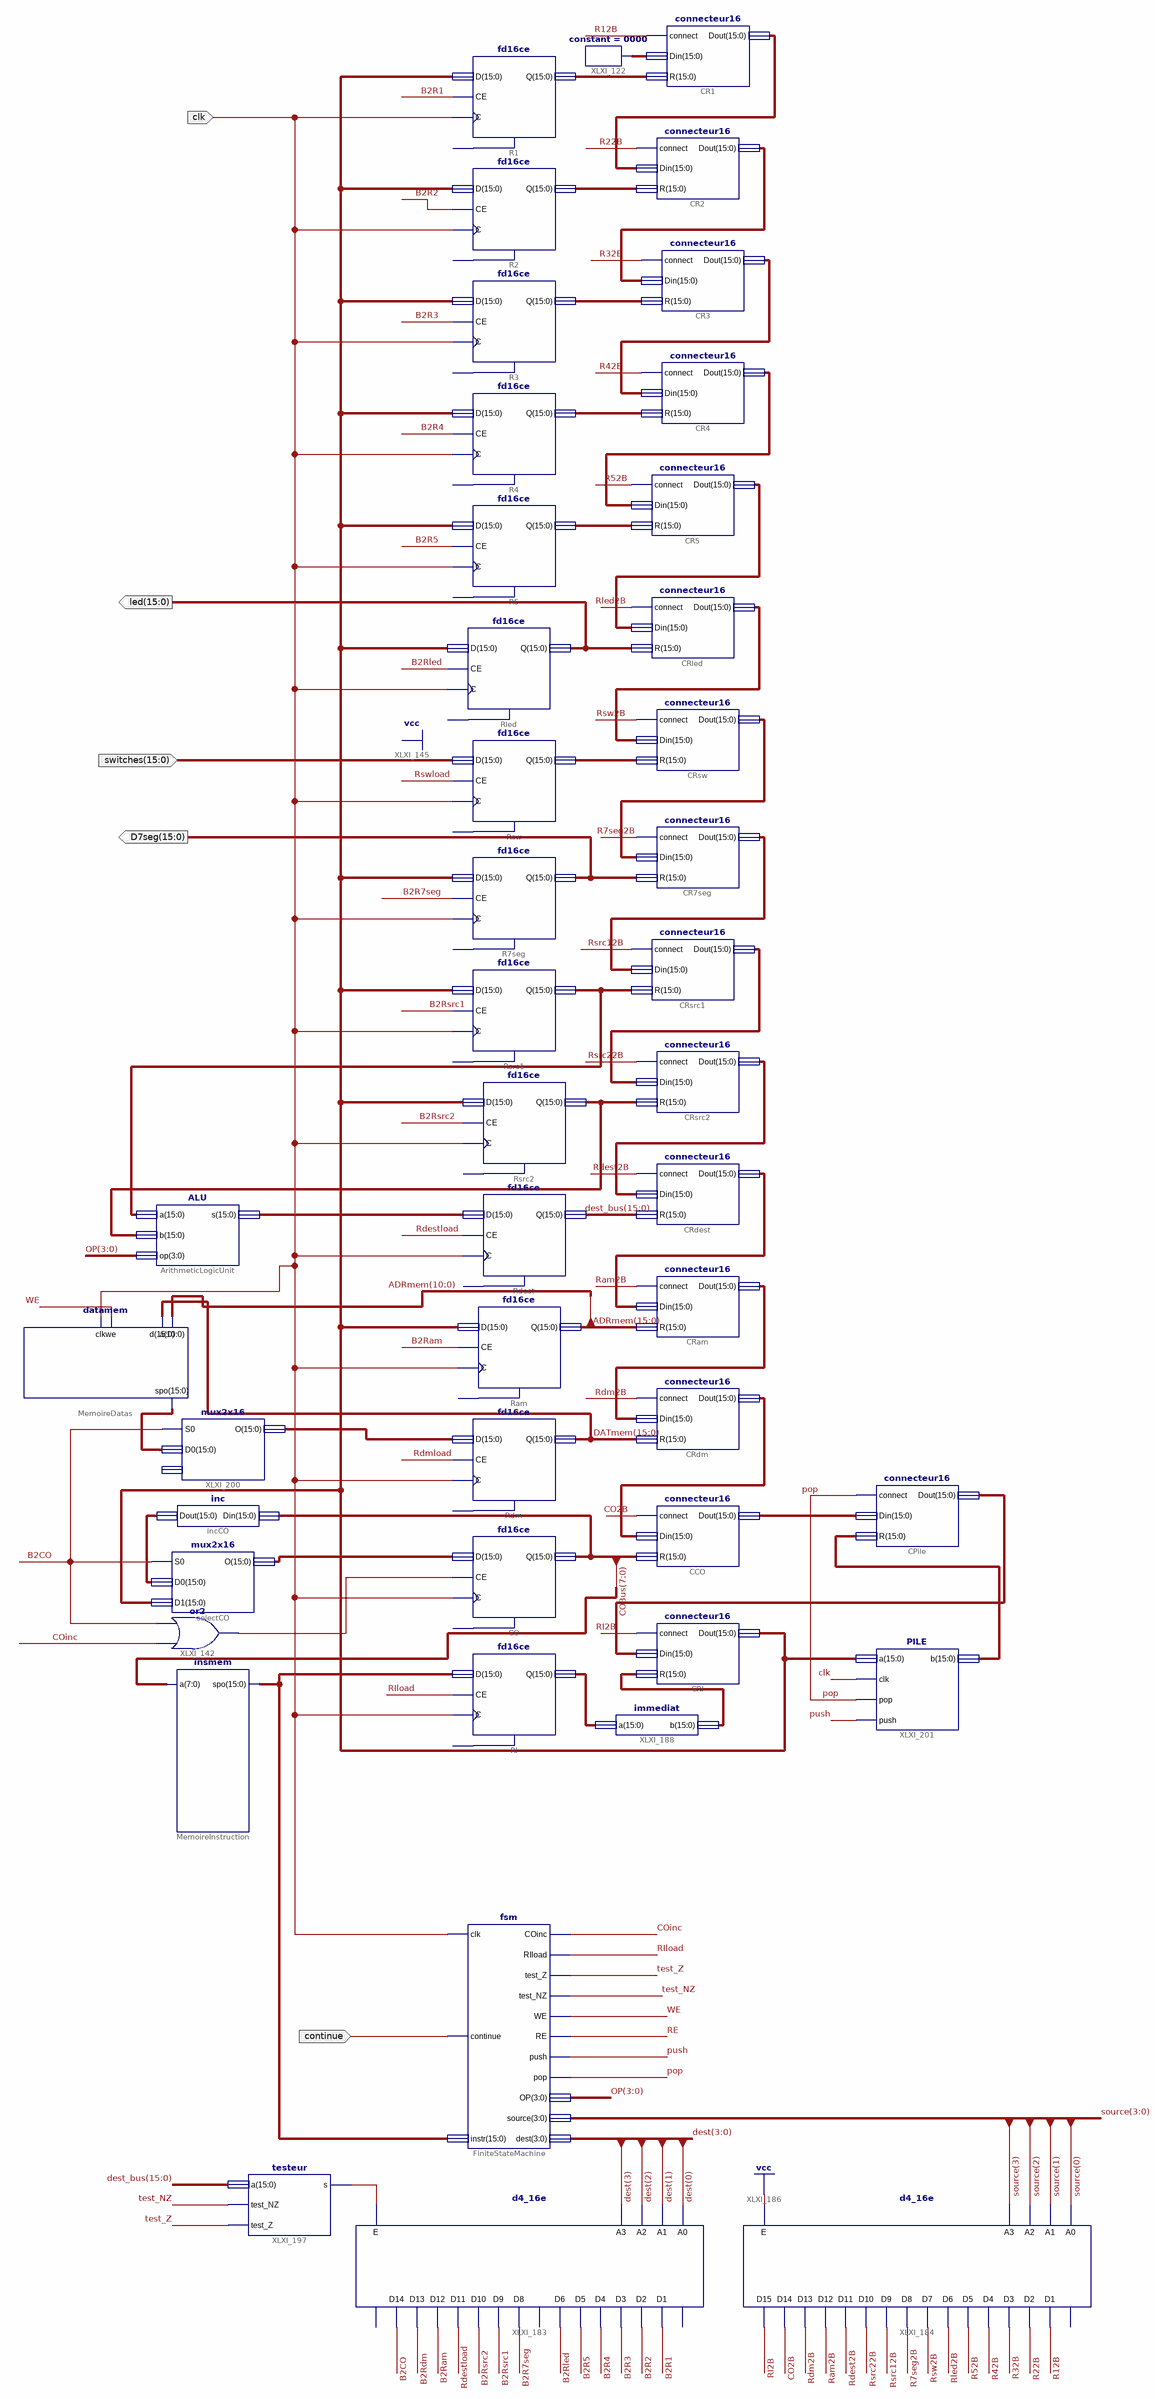
[diagram p0: schematic sheet 1]
// Xilinx ISE schematic S3.sch (spartan3e) as structural Verilog: 45 symbols, 5 ports
module S3 (
  input  clk,
  input  [15:0] switches,
  input  \continue ,
  output [15:0] led,
  output [15:0] D7seg
);

  wire B2CO, B2R1, B2R2, B2R3, B2R4, B2R5, B2R7seg, B2Ram, B2Rdm, B2Rled, B2Rsrc1, B2Rsrc2, CO2B, COinc, pop,
       push, R7seg2B, R12B, R22B, R32B, R42B, R52B, Ram2B, Rdest2B, Rdestload, Rdm2B, Rdmload, RE, RI2B,
       RIload, Rled2B, Rsrc12B, Rsrc22B, Rsw2B, test_NZ, test_Z, WE, XLXN_52, XLXN_659;
  wire [3:0] dest, OP, source;
  wire [15:0] ADRmem, COBus, DATmem, dest_bus, XLXN_1, XLXN_2, XLXN_3, XLXN_4, XLXN_5, XLXN_7, XLXN_9,
       XLXN_10, XLXN_17, XLXN_33, XLXN_34, XLXN_35, XLXN_36, XLXN_37, XLXN_38, XLXN_39, XLXN_40, XLXN_41,
       XLXN_42, XLXN_43, XLXN_44, XLXN_47, XLXN_49, XLXN_53, XLXN_57, XLXN_334, XLXN_366, XLXN_367, XLXN_368,
       XLXN_458, XLXN_459, XLXN_660, XLXN_661, XLXN_663;

  fd16ce R1 (.C(clk), .CE(B2R1), .D(XLXN_47), .Q(XLXN_1));  // open: CLR
  fd16ce R2 (.C(clk), .CE(B2R2), .D(XLXN_47), .Q(XLXN_2));  // open: CLR
  fd16ce R3 (.C(clk), .CE(B2R3), .D(XLXN_47), .Q(XLXN_3));  // open: CLR
  fd16ce R4 (.C(clk), .CE(B2R4), .D(XLXN_47), .Q(XLXN_4));  // open: CLR
  fd16ce R5 (.C(clk), .CE(B2R5), .D(XLXN_47), .Q(XLXN_5));  // open: CLR
  fd16ce Rled (.C(clk), .CE(B2Rled), .D(XLXN_47), .Q(led));  // open: CLR
  fd16ce Rsw (.C(clk), .CE(1'b1), .D(switches), .Q(XLXN_7));  // open: CLR
  fd16ce R7seg (.C(clk), .CE(B2R7seg), .D(XLXN_47), .Q(D7seg));  // open: CLR
  fd16ce Rsrc1 (.C(clk), .CE(B2Rsrc1), .D(XLXN_47), .Q(XLXN_9));  // open: CLR
  fd16ce Rsrc2 (.C(clk), .CE(B2Rsrc2), .D(XLXN_47), .Q(XLXN_10));  // open: CLR
  fd16ce Rdest (.C(clk), .CE(Rdestload), .D(XLXN_366), .Q(dest_bus));  // open: CLR
  fd16ce Ram (.C(clk), .CE(B2Ram), .D(XLXN_47), .Q(ADRmem));  // open: CLR
  fd16ce Rdm (.C(clk), .CE(Rdmload), .D(XLXN_458), .Q(DATmem));  // open: CLR
  fd16ce CO (.C(clk), .CE(XLXN_52), .D(XLXN_53), .Q(COBus));  // open: CLR
  fd16ce RI (.C(clk), .CE(RIload), .D(XLXN_57), .Q(XLXN_367));  // open: CLR
  connecteur16 CR2 (.connect(R22B), .Din(XLXN_33), .R(XLXN_2), .Dout(XLXN_34));
  connecteur16 CR3 (.connect(R32B), .Din(XLXN_34), .R(XLXN_3), .Dout(XLXN_35));
  connecteur16 CR4 (.connect(R42B), .Din(XLXN_35), .R(XLXN_4), .Dout(XLXN_36));
  connecteur16 CR5 (.connect(R52B), .Din(XLXN_36), .R(XLXN_5), .Dout(XLXN_37));
  connecteur16 CRled (.connect(Rled2B), .Din(XLXN_37), .R(led), .Dout(XLXN_38));
  connecteur16 CRsw (.connect(Rsw2B), .Din(XLXN_38), .R(XLXN_7), .Dout(XLXN_39));
  connecteur16 CR7seg (.connect(R7seg2B), .Din(XLXN_39), .R(D7seg), .Dout(XLXN_40));
  connecteur16 CRsrc1 (.connect(Rsrc12B), .Din(XLXN_40), .R(XLXN_9), .Dout(XLXN_41));
  connecteur16 CRsrc2 (.connect(Rsrc22B), .Din(XLXN_41), .R(XLXN_10), .Dout(XLXN_42));
  connecteur16 CRdest (.connect(Rdest2B), .Din(XLXN_42), .R(dest_bus), .Dout(XLXN_43));
  connecteur16 CRam (.connect(Ram2B), .Din(XLXN_43), .R(ADRmem), .Dout(XLXN_44));
  connecteur16 CRdm (.connect(Rdm2B), .Din(XLXN_44), .R(DATmem), .Dout(XLXN_334));
  connecteur16 CCO (.connect(CO2B), .Din(XLXN_334), .R(COBus), .Dout(XLXN_660));
  connecteur16 CRI (.connect(RI2B), .Din(XLXN_661), .R(XLXN_368), .Dout(XLXN_47));
  constant #(.CValue("0000")) XLXI_122 (.O(XLXN_17));
  connecteur16 CR1 (.connect(R12B), .Din(XLXN_17), .R(XLXN_1), .Dout(XLXN_33));
  or XLXI_142 (XLXN_52, COinc, B2CO);
  mux2x16 selectCO (.S0(B2CO), .D0(XLXN_49), .D1(XLXN_47), .O(XLXN_53));
  inc incCO (.Din(COBus), .Dout(XLXN_49));
  insmem MemoireInstruction (.a(COBus[7:0]), .spo(XLXN_57));
  ALU ArithmeticLogicUnit (.a(XLXN_9), .b(XLXN_10), .op(OP), .s(XLXN_366));
  fsm FiniteStateMachine (
    .clk(clk), .\continue (\continue ), .instr(XLXN_57), .COinc(COinc), .RIload(RIload), .test_Z(test_Z),
    .test_NZ(test_NZ), .WE(WE), .RE(RE), .push(push), .pop(pop), .OP(OP), .source(source), .dest(dest));
  immediat XLXI_188 (.a(XLXN_367), .b(XLXN_368));
  datamem MemoireDatas (.a(ADRmem[10:0]), .d(DATmem), .we(WE), .clk(clk), .spo(XLXN_459));
  mux2x16 XLXI_200 (.S0(B2CO), .D0(XLXN_459), .O(XLXN_458));  // open: D1
  d4_16e XLXI_184 (
    .A0(source[0]), .A1(source[1]), .A2(source[2]), .A3(source[3]), .E(1'b1), .D1(R12B), .D10(Rsrc22B),
    .D11(Rdest2B), .D12(Ram2B), .D13(Rdm2B), .D14(CO2B), .D15(RI2B), .D2(R22B), .D3(R32B), .D4(R42B),
    .D5(R52B), .D6(Rled2B), .D7(Rsw2B), .D8(R7seg2B), .D9(Rsrc12B));  // open: D0
  d4_16e XLXI_183 (
    .A0(dest[0]), .A1(dest[1]), .A2(dest[2]), .A3(dest[3]), .E(XLXN_659), .D1(B2R1), .D10(B2Rsrc2),
    .D11(Rdestload), .D12(B2Ram), .D13(B2Rdm), .D14(B2CO), .D2(B2R2), .D3(B2R3), .D4(B2R4), .D5(B2R5),
    .D6(B2Rled), .D8(B2R7seg), .D9(B2Rsrc1));  // open: D0, D15, D7
  testeur XLXI_197 (.a(dest_bus), .test_NZ(test_NZ), .test_Z(test_Z), .s(XLXN_659));
  PILE XLXI_201 (.a(XLXN_47), .clk(clk), .pop(pop), .push(push), .b(XLXN_663));
  connecteur16 CPile (.connect(pop), .Din(XLXN_660), .R(XLXN_663), .Dout(XLXN_661));
endmodule
